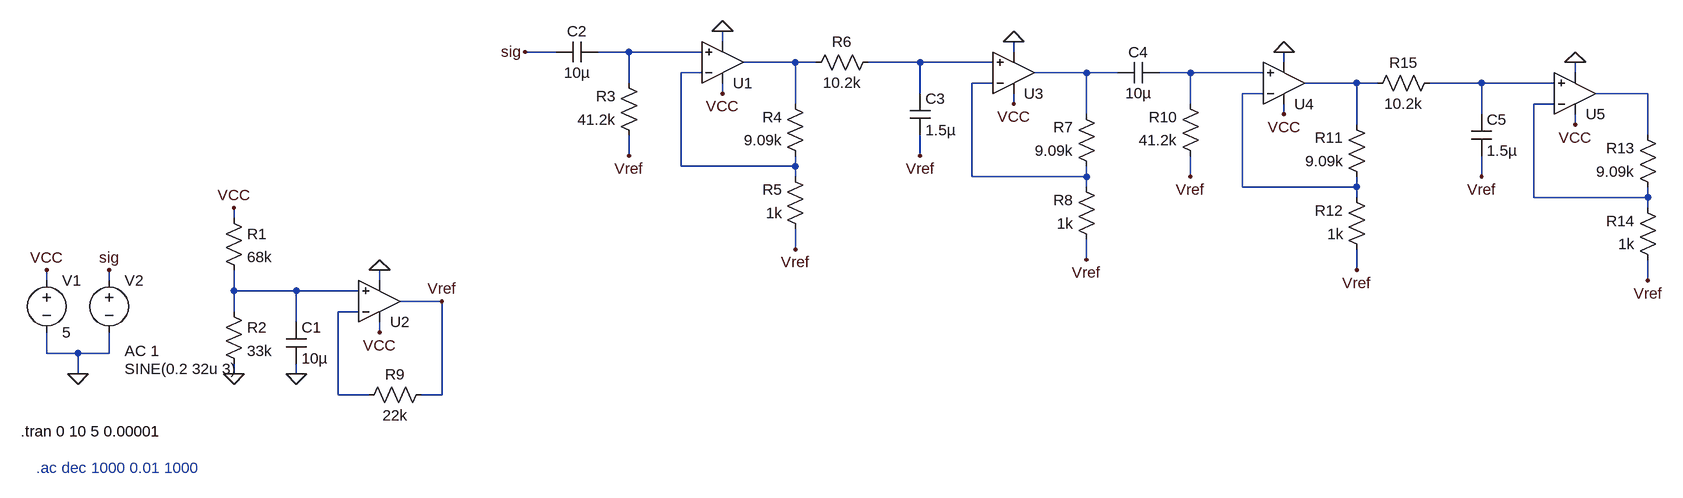
[diagram p0: schematic IF_amp_V4.asc]
IF_amp_V4.asc, the LTspice schematic file:
Version 4.1
SHEET 1 3456 680
WIRE 1136 -304 1136 -320
WIRE 880 -288 832 -288
WIRE 992 -288 944 -288
WIRE 1104 -288 992 -288
WIRE 1584 -288 1584 -304
WIRE 1248 -272 1168 -272
WIRE 1280 -272 1248 -272
WIRE 1440 -272 1360 -272
WIRE 1552 -272 1440 -272
WIRE 2000 -272 2000 -288
WIRE 1104 -256 1072 -256
WIRE 1696 -256 1616 -256
WIRE 1744 -256 1696 -256
WIRE 1856 -256 1808 -256
WIRE 1968 -256 1856 -256
WIRE 2448 -256 2448 -272
WIRE 992 -240 992 -288
WIRE 1552 -240 1520 -240
WIRE 2112 -240 2032 -240
WIRE 2144 -240 2112 -240
WIRE 2304 -240 2224 -240
WIRE 2416 -240 2304 -240
WIRE 1136 -224 1136 -240
WIRE 1440 -224 1440 -272
WIRE 1968 -224 1936 -224
WIRE 2560 -224 2480 -224
WIRE 1248 -208 1248 -272
WIRE 1584 -208 1584 -224
WIRE 1856 -208 1856 -256
WIRE 2416 -208 2384 -208
WIRE 1696 -192 1696 -256
WIRE 2000 -192 2000 -208
WIRE 2304 -192 2304 -240
WIRE 2112 -176 2112 -240
WIRE 2448 -176 2448 -192
WIRE 2560 -160 2560 -224
WIRE 992 -128 992 -160
WIRE 1440 -128 1440 -160
WIRE 1072 -112 1072 -256
WIRE 1248 -112 1248 -128
WIRE 1248 -112 1072 -112
WIRE 1248 -96 1248 -112
WIRE 1520 -96 1520 -240
WIRE 1696 -96 1696 -112
WIRE 1696 -96 1520 -96
WIRE 1856 -96 1856 -128
WIRE 2304 -96 2304 -128
WIRE 1696 -80 1696 -96
WIRE 1936 -80 1936 -224
WIRE 2112 -80 2112 -96
WIRE 2112 -80 1936 -80
WIRE 2112 -64 2112 -80
WIRE 2384 -64 2384 -208
WIRE 2560 -64 2560 -80
WIRE 2560 -64 2384 -64
WIRE 2560 -48 2560 -64
WIRE 384 -32 384 -48
WIRE 1248 16 1248 -16
WIRE 1696 32 1696 0
WIRE 2112 48 2112 16
WIRE 96 64 96 48
WIRE 192 64 192 48
WIRE 608 64 608 48
WIRE 2560 64 2560 32
WIRE 384 80 384 48
WIRE 480 80 384 80
WIRE 576 80 480 80
WIRE 704 96 640 96
WIRE 384 112 384 80
WIRE 576 112 544 112
WIRE 480 128 480 80
WIRE 608 144 608 128
WIRE 96 176 96 144
WIRE 144 176 96 176
WIRE 192 176 192 144
WIRE 192 176 144 176
WIRE 144 208 144 176
WIRE 384 208 384 192
WIRE 480 208 480 192
WIRE 544 240 544 112
WIRE 592 240 544 240
WIRE 704 240 704 96
WIRE 704 240 672 240
FLAG 144 208 0
FLAG 96 48 VCC
FLAG 192 48 sig
FLAG 1136 -224 VCC
FLAG 1136 -320 0
FLAG 608 144 VCC
FLAG 608 48 0
FLAG 480 208 0
FLAG 384 208 0
FLAG 384 -48 VCC
FLAG 704 96 Vref
FLAG 992 -128 Vref
FLAG 1248 16 Vref
FLAG 1584 -208 VCC
FLAG 1584 -304 0
FLAG 1440 -128 Vref
FLAG 1696 32 Vref
FLAG 832 -288 sig
FLAG 2000 -192 VCC
FLAG 2000 -288 0
FLAG 1856 -96 Vref
FLAG 2112 48 Vref
FLAG 2448 -176 VCC
FLAG 2448 -272 0
FLAG 2304 -96 Vref
FLAG 2560 64 Vref
SYMBOL voltage 96 48 R0
WINDOW 123 0 0 Left 0
WINDOW 39 0 0 Left 0
SYMATTR InstName V1
SYMATTR Value 5
SYMBOL voltage 192 48 R0
WINDOW 3 24 152 Left 2
WINDOW 123 24 124 Left 2
WINDOW 39 0 0 Left 0
SYMATTR InstName V2
SYMATTR Value SINE(0.2 32u 3)
SYMATTR Value2 AC 1
SYMBOL OpAmps\\UniversalOpAmp2 1136 -272 M180
SYMATTR InstName U1
SYMBOL res 368 -48 R0
SYMATTR InstName R1
SYMATTR Value 68k
SYMBOL res 368 96 R0
SYMATTR InstName R2
SYMATTR Value 33k
SYMBOL cap 464 128 R0
SYMATTR InstName C1
SYMATTR Value 10µ
SYMBOL OpAmps\\UniversalOpAmp2 608 96 M180
SYMATTR InstName U2
SYMBOL res 1008 -144 R180
WINDOW 0 36 76 Left 2
WINDOW 3 36 40 Left 2
SYMATTR InstName R3
SYMATTR Value 41.2k
SYMBOL res 1264 -112 R180
WINDOW 0 36 76 Left 2
WINDOW 3 36 40 Left 2
SYMATTR InstName R4
SYMATTR Value 9.09k
SYMBOL res 1264 0 R180
WINDOW 0 36 76 Left 2
WINDOW 3 36 40 Left 2
SYMATTR InstName R5
SYMATTR Value 1k
SYMBOL cap 944 -304 R90
WINDOW 0 0 32 VBottom 2
WINDOW 3 32 32 VTop 2
SYMATTR InstName C2
SYMATTR Value 10µ
SYMBOL OpAmps\\UniversalOpAmp2 1584 -256 M180
SYMATTR InstName U3
SYMBOL res 1712 -96 R180
WINDOW 0 36 76 Left 2
WINDOW 3 36 40 Left 2
SYMATTR InstName R7
SYMATTR Value 9.09k
SYMBOL res 1712 16 R180
WINDOW 0 36 76 Left 2
WINDOW 3 36 40 Left 2
SYMATTR InstName R8
SYMATTR Value 1k
SYMBOL cap 1424 -224 R0
SYMATTR InstName C3
SYMATTR Value 1.5µ
SYMBOL res 1376 -288 R90
WINDOW 0 0 56 VBottom 2
WINDOW 3 32 56 VTop 2
SYMATTR InstName R6
SYMATTR Value 10.2k
SYMBOL res 688 224 R90
WINDOW 0 0 56 VBottom 2
WINDOW 3 32 56 VTop 2
SYMATTR InstName R9
SYMATTR Value 22k
SYMBOL OpAmps\\UniversalOpAmp2 2000 -240 M180
SYMATTR InstName U4
SYMBOL res 1872 -112 R180
WINDOW 0 36 76 Left 2
WINDOW 3 36 40 Left 2
SYMATTR InstName R10
SYMATTR Value 41.2k
SYMBOL res 2128 -80 R180
WINDOW 0 36 76 Left 2
WINDOW 3 36 40 Left 2
SYMATTR InstName R11
SYMATTR Value 9.09k
SYMBOL res 2128 32 R180
WINDOW 0 36 76 Left 2
WINDOW 3 36 40 Left 2
SYMATTR InstName R12
SYMATTR Value 1k
SYMBOL cap 1808 -272 R90
WINDOW 0 0 32 VBottom 2
WINDOW 3 32 32 VTop 2
SYMATTR InstName C4
SYMATTR Value 10µ
SYMBOL OpAmps\\UniversalOpAmp2 2448 -224 M180
SYMATTR InstName U5
SYMBOL res 2576 -64 R180
WINDOW 0 36 76 Left 2
WINDOW 3 36 40 Left 2
SYMATTR InstName R13
SYMATTR Value 9.09k
SYMBOL res 2576 48 R180
WINDOW 0 36 76 Left 2
WINDOW 3 36 40 Left 2
SYMATTR InstName R14
SYMATTR Value 1k
SYMBOL cap 2288 -192 R0
SYMATTR InstName C5
SYMATTR Value 1.5µ
SYMBOL res 2240 -256 R90
WINDOW 0 0 56 VBottom 2
WINDOW 3 32 56 VTop 2
SYMATTR InstName R15
SYMATTR Value 10.2k
TEXT 56 296 Left 2 !.tran 0 10 5 0.00001
TEXT 80 352 Left 2 ;.ac dec 1000 0.01 1000

The netlist it stands for:
* IF_amp_V4.asc
V1 VCC 0 5
V2 sig 0 SINE(0.2 32u 3) AC 1
X§U1 N001 N004 VCC 0 N002 level2 Avol=1Meg GBW=10Meg Slew=10Meg Ilimit=25m Rail=0 Vos=0 En=0 Enk=0 In=0 Ink=0 Rin=500Meg  ; pins In+ In- V+ V- OUT
R1 VCC N013 68k
R2 N013 0 33k
C1 N013 0 10µ
X§U2 N013 N014 VCC 0 Vref level2 Avol=1Meg GBW=10Meg Slew=10Meg Ilimit=25m Rail=0 Vos=0 En=0 Enk=0 In=0 Ink=0 Rin=500Meg  ; pins In+ In- V+ V- OUT
R3 Vref N001 41.2k
R4 N004 N002 9.09k
R5 Vref N004 1k
C2 N001 sig 10µ
X§U3 N003 N007 VCC 0 N005 level2 Avol=1Meg GBW=10Meg Slew=10Meg Ilimit=25m Rail=0 Vos=0 En=0 Enk=0 In=0 Ink=0 Rin=500Meg  ; pins In+ In- V+ V- OUT
R7 N007 N005 9.09k
R8 Vref N007 1k
C3 N003 Vref 1.5µ
R6 N003 N002 10.2k
R9 Vref N014 22k
X§U4 N006 N010 VCC 0 N008 level2 Avol=1Meg GBW=10Meg Slew=10Meg Ilimit=25m Rail=0 Vos=0 En=0 Enk=0 In=0 Ink=0 Rin=500Meg  ; pins In+ In- V+ V- OUT
R10 Vref N006 41.2k
R11 N010 N008 9.09k
R12 Vref N010 1k
C4 N006 N005 10µ
X§U5 N009 N012 VCC 0 N011 level2 Avol=1Meg GBW=10Meg Slew=10Meg Ilimit=25m Rail=0 Vos=0 En=0 Enk=0 In=0 Ink=0 Rin=500Meg  ; pins In+ In- V+ V- OUT
R13 N012 N011 9.09k
R14 Vref N012 1k
C5 N009 Vref 1.5µ
R15 N009 N008 10.2k
.tran 0 10 5 0.00001
* .ac dec 1000 0.01 1000
.lib UniversalOpAmp2.lib
.backanno
.end